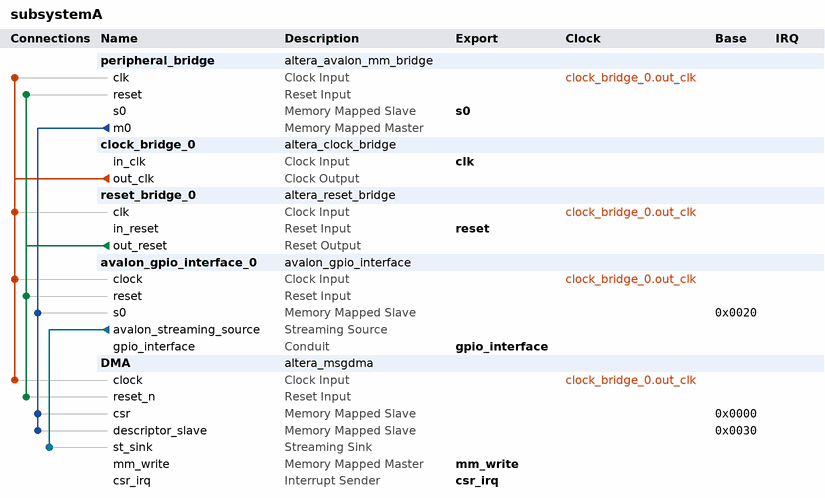
[diagram p0: system contents]
# Platform Designer (Qsys) system subsystemA, MAX 10 10M50DAF484C7G
# Parameters at their usual value, and those the tool derives, are not listed.
package require -exact qsys 18.1
create_system subsystemA
set_project_property DEVICE_FAMILY {MAX 10}
set_project_property DEVICE 10M50DAF484C7G

add_instance peripheral_bridge altera_avalon_mm_bridge 18.1
set_instance_parameter_value peripheral_bridge ADDRESS_UNITS SYMBOLS
set_instance_parameter_value peripheral_bridge ADDRESS_WIDTH 10
set_instance_parameter_value peripheral_bridge DATA_WIDTH 32
set_instance_parameter_value peripheral_bridge MAX_PENDING_RESPONSES 4
set_instance_parameter_value peripheral_bridge USE_AUTO_ADDRESS_WIDTH 0

add_instance clock_bridge_0 altera_clock_bridge 18.1
set_instance_parameter_value clock_bridge_0 DERIVED_CLOCK_RATE 0
set_instance_parameter_value clock_bridge_0 EXPLICIT_CLOCK_RATE 0

add_instance reset_bridge_0 altera_reset_bridge 18.1
set_instance_parameter_value reset_bridge_0 ACTIVE_LOW_RESET 0
set_instance_parameter_value reset_bridge_0 SYNCHRONOUS_EDGES deassert

add_instance avalon_gpio_interface_0 avalon_gpio_interface 1.0

add_instance DMA altera_msgdma 18.1
set_instance_parameter_value DMA BURST_ENABLE 0
set_instance_parameter_value DMA DATA_FIFO_DEPTH 32
set_instance_parameter_value DMA DATA_WIDTH 64
set_instance_parameter_value DMA DESCRIPTOR_FIFO_DEPTH 128
set_instance_parameter_value DMA ENHANCED_FEATURES 0
set_instance_parameter_value DMA ERROR_ENABLE 0
set_instance_parameter_value DMA MAX_BURST_COUNT 2
set_instance_parameter_value DMA MAX_BYTE 65536
set_instance_parameter_value DMA MODE 2
set_instance_parameter_value DMA PACKET_ENABLE 0
set_instance_parameter_value DMA TRANSFER_TYPE {Aligned Accesses}

# connections
add_connection clock_bridge_0.out_clk avalon_gpio_interface_0.clock clock
add_connection clock_bridge_0.out_clk DMA.clock clock
add_connection clock_bridge_0.out_clk peripheral_bridge.clk clock
add_connection clock_bridge_0.out_clk reset_bridge_0.clk clock
add_connection reset_bridge_0.out_reset avalon_gpio_interface_0.reset reset
add_connection reset_bridge_0.out_reset DMA.reset_n reset
add_connection reset_bridge_0.out_reset peripheral_bridge.reset reset
add_connection peripheral_bridge.m0 avalon_gpio_interface_0.s0 avalon
set_connection_parameter_value peripheral_bridge.m0/avalon_gpio_interface_0.s0 baseAddress 0x0020
add_connection peripheral_bridge.m0 DMA.csr avalon
set_connection_parameter_value peripheral_bridge.m0/DMA.csr baseAddress 0x0000
add_connection peripheral_bridge.m0 DMA.descriptor_slave avalon
set_connection_parameter_value peripheral_bridge.m0/DMA.descriptor_slave baseAddress 0x0030
add_connection avalon_gpio_interface_0.avalon_streaming_source DMA.st_sink avalon_streaming

# exported interfaces
add_interface clk clock sink
set_interface_property clk EXPORT_OF clock_bridge_0.in_clk
add_interface csr_irq interrupt sender
set_interface_property csr_irq EXPORT_OF DMA.csr_irq
add_interface gpio_interface conduit end
set_interface_property gpio_interface EXPORT_OF avalon_gpio_interface_0.gpio_interface
add_interface mm_write avalon master
set_interface_property mm_write EXPORT_OF DMA.mm_write
add_interface reset reset sink
set_interface_property reset EXPORT_OF reset_bridge_0.in_reset
add_interface s0 avalon slave
set_interface_property s0 EXPORT_OF peripheral_bridge.s0

set_interconnect_requirement {$system} qsys_mm.clockCrossingAdapter HANDSHAKE
set_interconnect_requirement {$system} qsys_mm.enableEccProtection FALSE
set_interconnect_requirement {$system} qsys_mm.insertDefaultSlave FALSE
set_interconnect_requirement {$system} qsys_mm.maxAdditionalLatency 1

save_system subsystemA.qsys
